# EAGLE schematic rgb_sensor (EAGLE 6.6.0)
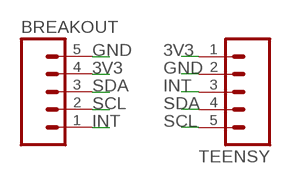
[diagram p0: schematic, sheet 1]

## Parts
BREAKOUT  M05PTH  [1X05]
TEENSY  M05PTH  [1X05]

## Nets
3V3: BREAKOUT.4 TEENSY.1
GND: BREAKOUT.5 TEENSY.2
INT: BREAKOUT.1 TEENSY.3
SCL: BREAKOUT.2 TEENSY.5
SDA: BREAKOUT.3 TEENSY.4

## Library data of the parts
BREAKOUT TEENSY = SparkFun-Connectors:M05: Header 5 Standard 5-pin 0.1" header. Use with straight break away headers (SKU : PRT-00116), right angle break away headers (PRT-00553), swiss pins (PRT-00743), machine pins (PRT-00117), and female headers (PRT-00115). Molex polarized connector foot print use with SKU : PRT-08230 with associated crimp pins and housings.